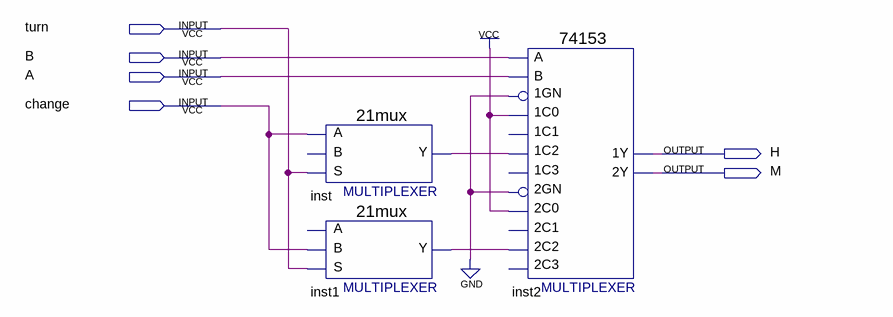
[diagram p0: schematic sheet]
// Quartus schematic control_alarm.bdf as structural Verilog: 3 symbols, 6 pins
module control_alarm (
  input  turn,
  input  B,
  input  A,
  input  change,
  output H,
  output M
);

  wire inst1_y, inst_y;

  \21mux  inst (.S(turn), .A(change), .Y(inst_y));  // open: B
  \21mux  inst1 (.S(turn), .B(change), .Y(inst1_y));  // open: A
  \74153  inst2 (
    .\1GN (1'b0), .\1C0 (1'b1), .\2C0 (1'b1), .\2GN (1'b0), .\2C2 (inst1_y), .\1C2 (inst_y), .B(A), .A(B),
    .\1Y (H), .\2Y (M));  // open: 1C1, 1C3, 2C1, 2C3
endmodule
